# EAGLE design main (EAGLE 9.5.0)
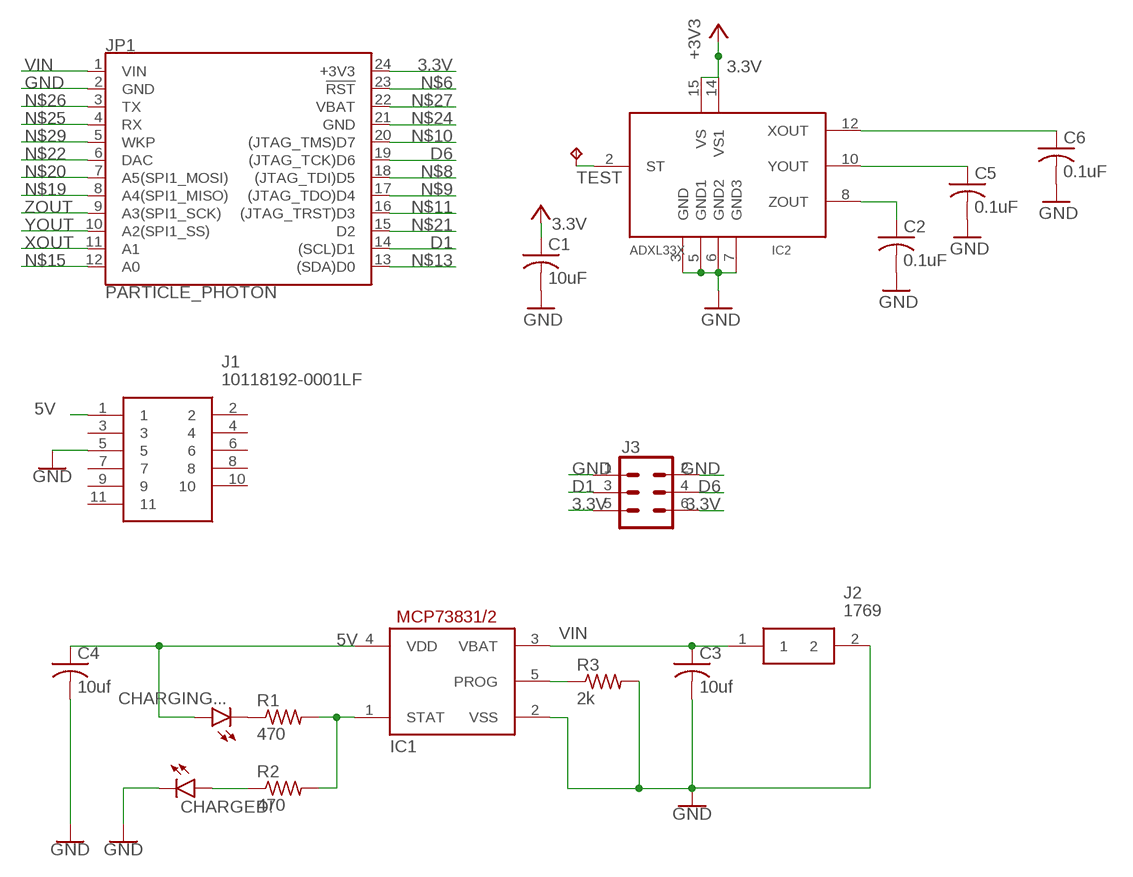
[diagram p0: schematic, sheet 1]

## Parts
C1  10uF  ADAFRUIT_C-USC1206K  [ADAFRUIT_C1206K]
C2  0.1uF  ADAFRUIT_C-USC1206K  [ADAFRUIT_C1206K]
C3  10uf  C-USC1206K  [C1206K]
C4  10uf  C-USC1206K  [C1206K]
C5  0.1uF  ADAFRUIT_C-USC1206K  [ADAFRUIT_C1206K]
C6  0.1uF  ADAFRUIT_C-USC1206K  [ADAFRUIT_C1206K]
CHARGED!  green  LED-FKIT-1206  [FKIT-LED-1206]
CHARGING...  blue  LED-FKIT-1206  [FKIT-LED-1206]
IC1  MCP73831/OT  [SOT23-5L]
IC2  ADXL33X  [16LCSP]
J1  10118192-0001LF  [101181920001LF]
J2  1769  [1769]
J3  CONN_03X2FEMALE_SMD  [2X3_SMD]
JP1  PARTICLE_PHOTON  [PARTICLE_PHOTON]
R1  470  R-US_M1206  [M1206]
R2  470  R-US_M1206  [M1206]
R3  2k  R-US_M1206  [M1206]
TEST  TPTP14R  [TP14R]

## Nets
3.3V: C1.1 IC2.14(VS1) IC2.15(VS) J3.5 J3.6 JP1.24(+3V3) ; supply symbol labelled +3V3
5V: C4.1 CHARGING....A IC1.4(VDD) J1.1
D1: J3.3 JP1.14((SCL)D1)
D6: J3.4 JP1.19((JTAG_TCK)D6)
GND: C1.2 C2.2 C3.2 C4.2 C5.2 C6.2 CHARGED!.C IC1.2(VSS) IC2.3(GND) IC2.5(GND1) IC2.6(GND2) IC2.7(GND3) J1.5 J2.2 J3.1 J3.2 JP1.2(GND) R3.2
N$1: IC1.1(STAT) R1.2 R2.2
N$2: CHARGING....C R1.1
N$3: CHARGED!.A R2.1
N$4: IC1.5(PROG) R3.1
N$6: JP1.23(!RST!)
N$8: JP1.18((JTAG_TDI)D5)
N$9: JP1.17((JTAG_TDO)D4)
N$10: JP1.20((JTAG_TMS)D7)
N$11: JP1.16((JTAG_TRST)D3)
N$13: JP1.13((SDA)D0)
N$15: JP1.12(A0)
N$19: JP1.8(A4(SPI1_MISO))
N$20: JP1.7(A5(SPI1_MOSI))
N$21: JP1.15(D2)
N$22: JP1.6(DAC)
N$24: JP1.21(GND)
N$25: JP1.4(RX)
N$26: JP1.3(TX)
N$27: JP1.22(VBAT)
N$29: JP1.5(WKP)
TEST: IC2.2(ST) TEST.TP
VIN: C3.1 IC1.3(VBAT) J2.1 JP1.1(VIN)
XOUT: C6.1 IC2.12(XOUT) JP1.11(A1)
YOUT: C5.1 IC2.10(YOUT) JP1.10(A2(SPI1_SS))
ZOUT: C2.1 IC2.8(ZOUT) JP1.9(A3(SPI1_SCK))
Unconnected: J1.2 J1.3 J1.4 J1.6 J1.7 J1.8 J1.9 J1.10 J1.11

## Library data of the parts
C1 C2 C5 C6 = Adafruit ADXL335.rpt:ADAFRUIT_C-US: CAPACITOR, American symbol
C3 C4 = adafruit:C-US: CAPACITOR, American symbol
CHARGED! CHARGING... = SparkFun-LED:LED: LED (Generic) Standard schematic elements and footprints for 5mm, 3mm, 1206, and 0603 sized LEDs. Generic LEDs with no color specified.
IC1 = miguel:MCP73831: MCP73831/2 Miniature Single-Cell, Fully Integrated Li-Ion, Li-Polymer Charge Management Controllers. Nice and small simple lipoly charge controller, with adjustable current and status output (LED) http://www.ladyada.net/library/pcb/eaglelibrary.html
IC2 = adafruit:ADXL33X
J1 = SamacSys_Parts:10118192-0001LF: USB Connectors 5P MICRO USB TYPE B RECEPTACLE Source: Datasheet <https://www.mouser.tw/datasheet/2/18/10118192-1361887.pdf>; ALLIED_NUMBER: 70236826; ALLIED_PRICE-STOCK: https://www.alliedelec.com/amphenolfci-10118192-0001lf/70236826/; DESCRIPTION: USB Connectors 5P MICRO USB TYPE B RECEPTACLE; HEIGHT: 2.8mm; MANUFACTURER_NAME: FCI / Amphenol; MANUFACTURER_PART_NUMBER: 10118192-0001LF; MOUSER_PART_NUMBER: 649-10118192-0001LF
J2 = SamacSys_Parts:1769: Adafruit Accessories JST-PH 2-pin SMT Right Angle Connect Source: Datasheet <https://cdn-shop.adafruit.com/datasheets/17311.pdf>; ALLIED_NUMBER: 70927965; ALLIED_PRICE-STOCK: https://www.alliedelec.com/adafruit-industries-1769/70927965/; DESCRIPTION: Adafruit Accessories JST-PH 2-pin SMT Right Angle Connect; HEIGHT: mm; MANUFACTURER_NAME: Adafruit; MANUFACTURER_PART_NUMBER: 1769; MOUSER_PART_NUMBER: 485-1769; MOUSER_PRICE-STOCK: https://www.mouser.com/Search/Refine.aspx?Keyword=485-1769
J3 = SparkFun-Connectors:CONN_03X2: Multi connection point. Often used as Generic Header-pin footprint for 0.1 inch spaced/style header connections You can populate with any combo of single row headers, but if you'd like an exact match, check these: Header - 2x3 (Male, 0.1") <https://www.sparkfun.com/products/12807> (PRT-12807) Header - 2x3 (Female, 0.1") <https://www.sparkfun.com/products/13010> (PRT-13010) 2x3 Pin Shrouded Header <https://www.sparkfun.com/products/10877> (PRT-10877) On any of the 0.1 inch spaced packages, you can populate with these: Break Away Headers - Straight <https://www.sparkfun.com/products/116> (PRT-00116) Break Away Male Headers - Right Angle <https://www.sparkfun.com/products/553> (PRT-00553) Female Headers <https://www.sparkfun.com/products/115> (PRT-00115) Break Away Headers - Machine Pin <https://www.sparkfun.com/products/117> (PRT-00117) Break Away Female Headers - Swiss Machine Pin <https://www.sparkfun.com/products/743> (PRT-00743) Special note: the shrouded connector mates well with our 3x2 ribbon cables: Ribbon Crimp Connector - 6-pin (2x3, Female) <https://www.sparkfun.com/products/10651> (PRT-10651) Ribbon Cable - 6 wire (15ft) <https://www.sparkfun.com/products/10646> (PRT-10646); PROD_ID: CONN-11290
JP1 = SparkFun-Boards2:PARTICLE_PHOTON: Particle Photon Footprint of the Particle Photon that is used as a basis for many Photon shields. SparkFun Products: Particle Photon <https://www.sparkfun.com/products/13764> SparkFun Photon ProtoShield <https://www.sparkfun.com/products/13598> SparkFun Photon micro OLED Shield <https://www.sparkfun.com/products/13628> SparkFun Photon IMU Shield <https://www.sparkfun.com/products/13629> SparkFun Photon Battery Shield <https://www.sparkfun.com/products/13626>
R1-R3 = adafruit:R-US_: RESISTOR, American symbol
TEST = testpad:TP: Test pad

## Board
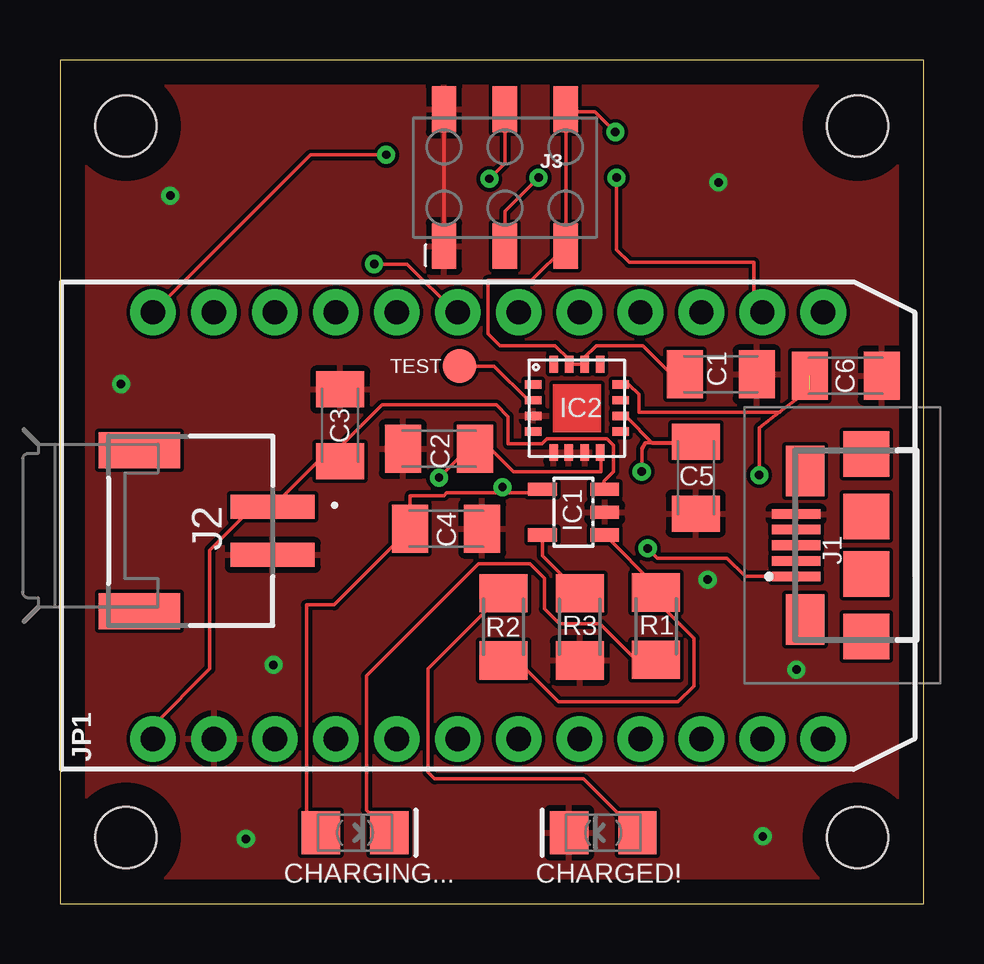
[diagram p1: board, top side]
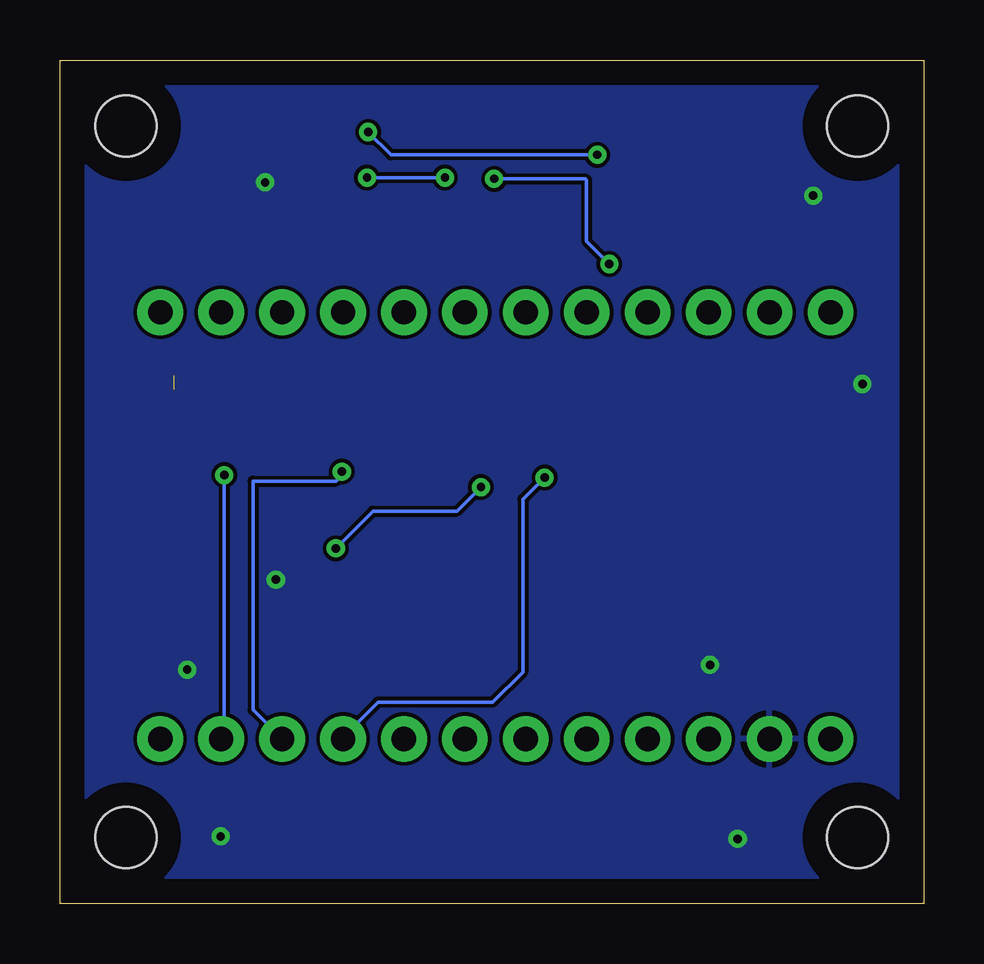
[diagram p2: board, bottom side, seen from below]

Size 36 x 35.15 mm. Coordinates in mm from the lower left corner, seen from the top.
Outline: 0,0 36,0 36,35.15 0,35.15 0,0
Copper layers (1*16): Top 0.035mm / dielectric 1.5mm / Bottom 0.035mm
Design rules "default": minimum track width 6mil, minimum drill 0.35mm, track to track 6mil, track to pad 6mil, pad to pad 6mil, via to via 6mil, smd to smd 6mil, copper to edge 40mil, drill to drill 6mil, minimum pad ring 10mil, minimum via ring 8mil, stop-mask expansion 4mil, vias tented up to drill 0mil, thermal gap 10mil
Holes 2.54 mm at 2.75,32.4 33.25,32.4 2.75,2.75 33.25,2.75

### Footprints (pad centres in the part's own frame; a part is rotated, then mirrored left to right if it is on the bottom)
ADAFRUIT_C1206K = smd 1.5 x 2: 1 -1.5,0; 2 1.5,0
C1206K = smd 1.5 x 2: 1 -1.5,0; 2 1.5,0
FKIT-LED-1206 = smd 1.6 x 1.803: A -1.422,0; C 1.422,0
SOT23-5L = smd 0.55 x 1.2: 1 -0.95,-1.3; 2 0,-1.3; 3 0.95,-1.3; 4 0.95,1.3; 5 -0.95,1.3
16LCSP = smd 0.7 x 0.35: 1 -1.825,0.975; 2 -1.825,0.325; 3 -1.825,-0.325; 4 -1.825,-0.975; 9 1.825,-0.975; 10 1.825,-0.325; 11 1.825,0.325; 12 1.825,0.975 | smd 0.35 x 0.7: 5 -0.975,-1.85; 6 -0.35,-1.85; 7 0.325,-1.85; 8 0.975,-1.85; 13 0.975,1.825; 14 0.325,1.825; 15 -0.325,1.825; 16 -0.975,1.825
101181920001LF = smd 0.4 x 2.032: 1 -1.3,1.936; 2 -0.65,1.936; 3 0,1.936; 4 0.65,1.936; 5 1.3,1.936 | smd 2.1 x 1.6: 6 -3.1,1.557; 7 3.1,1.557 | smd 1.9 x 1.9: 8 -1.2,-0.993; 9 1.2,-0.993; 10 -3.8,-0.993; 11 3.8,-0.993
1769 = smd 1 x 3.5: 1 -1,0; 2 1,0 | smd 1.5 x 3.4: 3 -3.35,-5.55; 4 3.35,-5.55
2X3_SMD = smd 1.02 x 1.9: 1 -2.54,-2.85; 2 -2.54,2.85; 3 0,-2.85; 4 0,2.85; 5 2.54,-2.85; 6 2.54,2.85
PARTICLE_PHOTON = drill 1.016 pad 1.905: 1 -8.89,13.97; 2 -8.89,11.43; 3 -8.89,8.89; 4 -8.89,6.35; 5 -8.89,3.81; 6 -8.89,1.27; 7 -8.89,-1.27; 8 -8.89,-3.81; 9 -8.89,-6.35; 10 -8.89,-8.89; 11 -8.89,-11.43; 12 -8.89,-13.97; 13 8.89,-13.97; 14 8.89,-11.43; 15 8.89,-8.89; 16 8.89,-6.35; 17 8.89,-3.81; 18 8.89,-1.27; 19 8.89,1.27; 20 8.89,3.81; 21 8.89,6.35; 22 8.89,8.89; 23 8.89,11.43; 24 8.89,13.97
M1206 = smd 1.6 x 2: 1 -1.4,0; 2 1.4,0
TP14R = smd 1.4 x 1.4: TP 0,0

### Placement (x,y rotation side)
C1  27.55,22.05 0 top
C2  15.8,18.95 180 top
C3  11.68,19.93 90 top
C4  16.1,15.62 0 top
C5  26.5,17.75 270 top
C6  32.75,22 0 top
CHARGED!  22.65,2.95 180 top
CHARGING...  12.3,2.95 0 top
IC1  21.41,16.31 90 top
IC2  21.55,20.65 0 top
J1  32.62,14.93 90 top
J2  8.87,15.53 270 top
J3  18.55,30.25 0 top
JP1  17.85,15.75 90 top
R1  24.85,11.56 90 top
R2  18.49,11.53 270 top
R3  21.67,11.53 270 top
TEST  16.65,22.4 0 top

### Tracks (layer width: path | path; a pad name or v marks a point on that pad's centre or on a via)
3.3V  (via drill 0.35)
  Top 0.152: C1.1 25.64,21.91 24.3,23.25 22.36,23.25 21.87,22.77 IC2.14 IC2.15 21.23,22.67 20.64,23.25 18.34,23.25 17.84,23.75 17.84,25.97 19.66,25.97 J3.5 21.09,33 | J3.6 21.09,33 | JP1.24 10.44,31.2 v13.6,31.2 | v23.15,32.15 22.3,33 21.09,33
  Bottom 0.152: v13.6,31.2 22.2,31.2 v23.15,32.15
5V  (via drill 0.35)
  Top 0.152: 18.45,17.11 19.96,17.11 IC1.4 | 18.45,17.11 16.11,17.11 16,17 14.6,17 C4.1 11.43,12.45 10.28,12.45 10.28,3.55 CHARGING....A | J1.1 28.57,13.63 27.8,14.4 24.9,14.4 v24.5,14.8 | v18.45,17.35 18.45,17.11
  Bottom 0.152: v24.5,14.8 22.95,16.35 19.45,16.35 v18.45,17.35
D1  (via drill 0.35)
  Top 0.152: JP1.14 28.93,24.99 28.93,26.72 23.73,26.72 23.2,27.25 v23.2,30.25 | J3.3 18.55,28.85 v19.95,30.25
  Bottom 0.152: v19.95,30.25 v23.2,30.25
D6  (via drill 0.35)
  Top 0.152: v13.1,26.65 14.47,26.65 16.48,24.64 JP1.19 | J3.4 18.55,30.85 v17.9,30.2
  Bottom 0.152: v17.9,30.2 14.1,30.2 14.05,30.15 14.05,27.6 v13.1,26.65
GND  (via drill 0.35)
  Top 0.152: 28.55,22.69 C1.2 | J3.2 J3.1
  other vias: 27,13.5 29.3,2.8 30.7,9.75 7.75,2.7 8.9,9.95 2.55,21.65 4.6,29.5 27.45,30.05
  pour Top: 0.15,0.15 0.15,34.95 0.25,35.05 35.3,35.05 35.95,34.4 35.95,0.25 36.25,-0.05
  pour Bottom: 0.15,0.1 0.15,35.1 35.15,35.1 35.95,34.3 35.95,0.55 35.5,0.1
N$1
  Top 0.152: IC1.1 24.85,13.22 R1.2 24.85,12.63 26.43,11.05 26.43,9.06 25.77,8.4 20.77,8.4 19.05,10.13 R2.2
N$2
  Top 0.152: CHARGING....C 12.77,3.9 12.77,9.48 17.45,14.16 19.59,14.16 20.19,13.55 20.19,12.29 20.82,11.65 22.52,11.65 24.01,10.16 R1.1
N$3
  Top 0.152: R2.1 15.34,9.78 15.34,5.48 15.62,5.2 21.82,5.2 CHARGED!.A
N$4
  Top 0.152: R3.1 20.11,14.49 IC1.5
TEST
  Top 0.152: TEST.TP 18.1,22.4 19.53,20.98 IC2.2
VIN
  Top 0.152: JP1.1 3.88,7.42 6.25,9.79 6.25,14.73 8.07,16.55 8.85,16.55 J2.1 10.77,18.43 C3.1 11.68,19.03 13.43,20.78 18.2,20.78 18.68,20.3 18.68,19.16 20.08,19.16 20.3,19.38 22.8,19.38 23.08,19.09 23.08,18 22.68,17.6 22.68,17.23 IC1.3
XOUT  (via drill 0.35)  (1 unrouted)
  Top 0.152: IC2.12 23.73,21.62 24.12,21.23 24.12,20.48 30,20.48 30.02,20.49 | v29.15,17.85 29.15,19.82 30.02,20.49 | 31.25,21.44 30.02,20.49
  Bottom 0.152: v29.15,17.85 29.15,6.99 JP1.11
YOUT  (via drill 0.35)
  Top 0.152: IC2.10 23.42,20.28 23.62,20.28 24.71,19.19 26.54,19.19 26.5,19.23 C5.1 26.45,19.2 24.41,19.2 24.25,18.95 v24.25,18
  Bottom 0.152: v24.25,18 24.25,17.85 24.5,17.6 27.95,17.6 27.95,8.07 JP1.10
ZOUT  (via drill 0.35)
  Top 0.152: IC2.8 22.55,18.77 22.55,18 18.9,18 17.41,19.49 C2.1 17,18.95 v15.8,17.75
  Bottom 0.152: v15.8,17.75 16.7,16.85 16.7,9.65 17.96,8.39 22.75,8.39 24.2,6.94 JP1.9

### Text on the board
bNames: Perkins+Will / Cubeio V2 / / September 2019